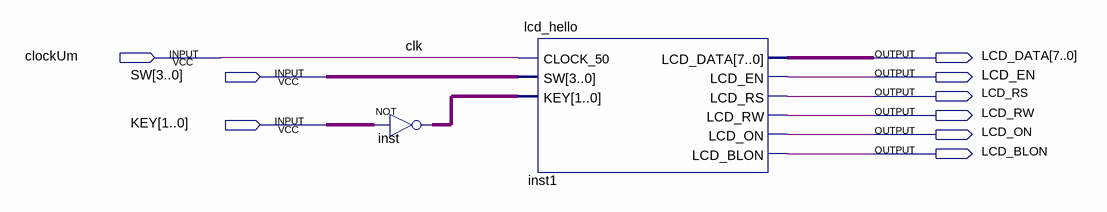
[diagram p0: schematic sheet]
// Quartus schematic testeteste.bdf as structural Verilog: 2 symbols, 9 pins
module testeteste (
  input  clockUm,
  input  [3:0] SW,
  input  [1:0] KEY,
  output [7:0] LCD_DATA,
  output LCD_EN,
  output LCD_RS,
  output LCD_RW,
  output LCD_ON,
  output LCD_BLON
);

  wire [1:0] inst_out;

  assign inst_out = ~KEY;  // NOT inst, 2 bits wide
  lcd_hello inst1 (
    .CLOCK_50(clockUm), .SW(SW), .KEY(inst_out), .LCD_DATA(LCD_DATA), .LCD_EN(LCD_EN), .LCD_RS(LCD_RS),
    .LCD_RW(LCD_RW), .LCD_ON(LCD_ON), .LCD_BLON(LCD_BLON));

  // Other names for the same wires on the sheet: clk = clockUm
endmodule
